# EAGLE schematic schematic (EAGLE 7.1.0)
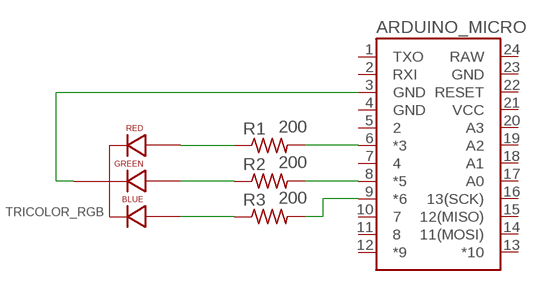
[diagram p0: schematic, sheet 1]

## Parts
ARDUINO_MICRO  ARDUINO_PRO_MICRO  [ARDUINO_PRO_MICRO]
R1  200  R-US_0204/2V  [0204V]
R2  200  R-US_0204/2V  [0204V]
R3  200  R-US_0204/2V  [0204V]
TRICOLOR_RGB  LED-RGB-CC-THRUCLEAR  [LED-RGB-THRU]

## Nets
N$1: ARDUINO_MICRO.6(*3) R1.2
N$2: ARDUINO_MICRO.8(*5) R2.2
N$3: ARDUINO_MICRO.9(*6) R3.2
N$4: R1.1 TRICOLOR_RGB.1(RED_CATHODE)
N$5: R2.1 TRICOLOR_RGB.3(GREEN_CATHODE)
N$6: R3.1 TRICOLOR_RGB.4(BLUE_CATHODE)
N$7: ARDUINO_MICRO.3(GND) TRICOLOR_RGB.2(CATHODE)
Unconnected: ARDUINO_MICRO.1(TXO) ARDUINO_MICRO.2(RXI) ARDUINO_MICRO.4(GND) ARDUINO_MICRO.5 ARDUINO_MICRO.7 ARDUINO_MICRO.10 ARDUINO_MICRO.11 ARDUINO_MICRO.12(*9) ARDUINO_MICRO.13(*10) ARDUINO_MICRO.14(11(MOSI)) ARDUINO_MICRO.15(12(MISO)) ARDUINO_MICRO.16(13(SCK)) ARDUINO_MICRO.17(A0) ARDUINO_MICRO.18(A1) ARDUINO_MICRO.19(A2) ARDUINO_MICRO.20(A3) ARDUINO_MICRO.21(VCC) ARDUINO_MICRO.22(RESET) ARDUINO_MICRO.23(GND) ARDUINO_MICRO.24(RAW)

## Library data of the parts
ARDUINO_MICRO = SparkFun-Boards:ARDUINO_PRO_MICRO
R1-R3 = resistor:R-US_: RESISTOR, American symbol
TRICOLOR_RGB = SparkFun-LED:LED-RGB-CC-THRU: RGB Through-hole common cathode LED SparkFun Storefront: COM-00105 (Clear) COM-09264 (Diffuse); PROD_ID: DIO-08418